# EAGLE design p0-001 (EAGLE 9.5.2)
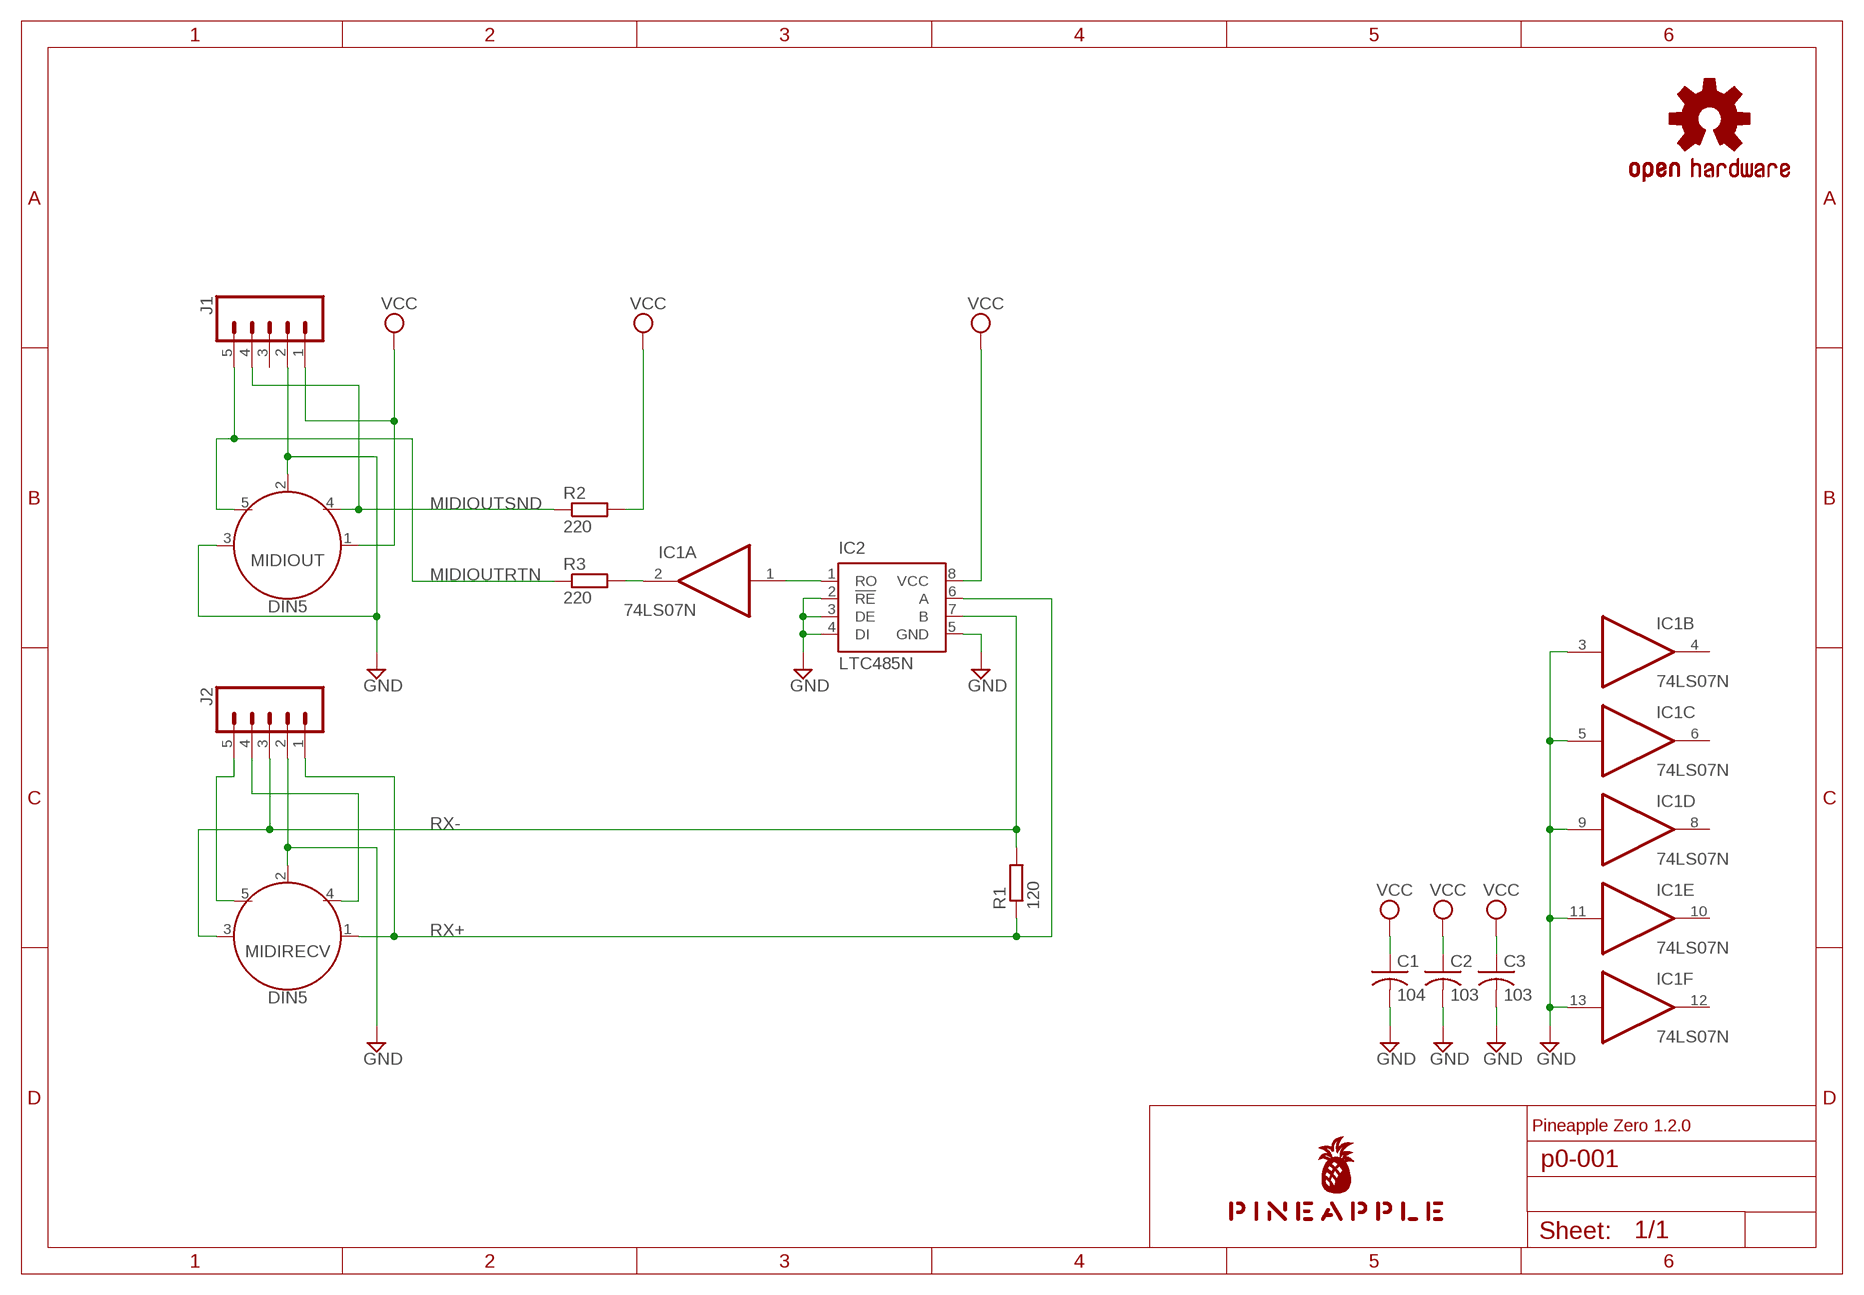
[diagram p0: schematic, sheet 1]

## Parts
C1  104  C-US025-025X050  [C025-025X050]
C2  103  C-US025-025X050  [C025-025X050]
C3  103  C-US025-025X050  [C025-025X050]
IC1  74LS07N  [DIL14]
IC2  LTC485N  [DIL08]
J1  CONN_05JST  [JST-5-PTH]
J2  CONN_05JST  [JST-5-PTH]
LOGO1  OSHW-LOGOS-COPPER  [OSHW-LOGO-S_COPPER]
MIDIOUT  DIN5  [DIN5-RA-PTH]
MIDIRECV  DIN5  [DIN5-RA-PTH]
R1  120  R-EU_0204/5  [0204/5]
R2  220  R-EU_0204/5  [0204/5]
R3  220  R-EU_0204/5  [0204/5]
U$1  PINEAPPLE450  [PINEAPPLE450]

## Nets
DUMMY4: J2.4 MIDIRECV.4
DUMMY5: J2.5 MIDIRECV.5
GND [power]: C1.2 C2.2 C3.2 IC1.3(B:I) IC1.5(C:I) IC1.9(D:I) IC1.11(E:I) IC1.13(F:I) IC2.2(!RE) IC2.3(DE) IC2.4(DI) IC2.5(GND) J1.2 J2.2 MIDIOUT.2 MIDIOUT.3 MIDIRECV.2
MIDIOUTRTN: J1.5 MIDIOUT.5 R3.1
MIDIOUTSND: J1.4 MIDIOUT.4 R2.1
N$1: IC1.2(A:O) R3.2
RX+: IC2.6(A) J2.1 MIDIRECV.1 R1.1
RX-: IC2.7(B) J2.3 MIDIRECV.3 R1.2
TX: IC1.1(A:I) IC2.1(RO)
VCC [power]: C1.1 C2.1 C3.1 IC2.8(VCC) J1.1 MIDIOUT.1 R2.2
Unconnected: IC1.4(B:O) IC1.6(C:O) IC1.8(D:O) IC1.10(E:O) IC1.12(F:O) J1.3

## Notes on the sheet
- Pineapple Zero 1.2.0

## Power pins joined to a net without a drawn wire
GND: IC1.7(P:GND)
VCC: IC1.14(P:VCC)

## Library data of the parts
C1-C3 = rcl:C-US: CAPACITOR, American symbol; SPICEPREFIX: C
IC1 = 74xx-us:74*07: Hex BUFFER, open collector high-voltage output
IC2 = linear-technology:LTC485: Low Power RS485 Interface Transceiver Source: http://www.linear.com/pc/downloadDocument.do?navId=H0,C1,C1007,C1017,P2064,D1718; OC_FARNELL: unknown; OC_NEWARK: unknown
J1 J2 = SparkFun-Connectors:CONN_05: Multi connection point. Often used as Generic Header-pin footprint for 0.1 inch spaced/style header connections On any of the 0.1 inch spaced packages, you can populate with these: Break Away Headers - Straight <https://www.sparkfun.com/products/116> (PRT-00116) Break Away Male Headers - Right Angle <https://www.sparkfun.com/products/553> (PRT-00553) Female Headers <https://www.sparkfun.com/products/115> (PRT-00115) Break Away Headers - Machine Pin <https://www.sparkfun.com/products/117> (PRT-00117) Break Away Female Headers - Swiss Machine Pin <https://www.sparkfun.com/products/743> (PRT-00743) For SCREWTERMINALS and SPRING TERMINALS visit here: Screw Terimnals on SparkFun.com <https://www.sparkfun.com/search/results?term=Screw+Terminals> (5mm/3.5mm/2.54mm spacing) This device is also useful as a general connection point to wire up your design to another part of your project. Our various solder wires solder well into these plated through hole pads. Hook-Up Wire - Assortment (Stranded, 22 AWG) <https://www.sparkfun.com/products/11375> (PRT-11375) Hook-Up Wire - Assortment (Solid Core, 22 AWG) <https://www.sparkfun.com/products/11367> (PRT-11367) View the entire wire category on our website here <https://www.sparkfun.com/categories/141> Special notes: Molex polarized connector foot print use with SKU : PRT-08231 with associated crimp pins and housings. 1MM SMD Version SKU: PRT-10208; SF_ID: PRT-09917
LOGO1 = SparkFun-Aesthetics:OSHW-LOGO: Open-Source Hardware (OSHW) Logo This logo indicates the piece of hardware it is found on incorporates a OSHW license and/or adheres to the definition of open source hardware found here: http://freedomdefined.org/OSHW
MIDIOUT MIDIRECV = SparkFun-Connectors:DIN5: DIN5 Connector - Female Right Angle (frequently used as a MIDI Jack connector) This type of connector and cable is frequently used for transmitting midi data (musical instrument digital interface). It is what you usually see on a keyboard or set of electronic drums. Learn more here <https://en.wikipedia.org/wiki/MIDI>. For more information on the pinout and electrical specifications of MIDI communications, please see the following resource: https://www.midi.org/specifications/item/midi-din-electrical-specification Here is the connector we sell at SparkFun: MIDI Connector - Female Right Angle <https://www.sparkfun.com/products/9536> (PRT-09536) Datasheet <hhttp://www.sparkfun.com/datasheets/Prototyping/Connectors/MIDI-RA.pdf> It is used on this SparkFun product: SparkFun MIDI Shield <https://www.sparkfun.com/products/12898> (DEV-12898); PROD_ID: CONN-09481
R1-R3 = resistor:R-EU_: RESISTOR, European symbol
U$1 = pineapple:PINEAPPLE450

## Net classes
0 default: width 0.152 mm, drill 0.152 mm, clearance 0.152 mm
1 power: width 0.305 mm, drill 0.152 mm, clearance 0.152 mm to class 0, clearance 0.152 mm

## Board
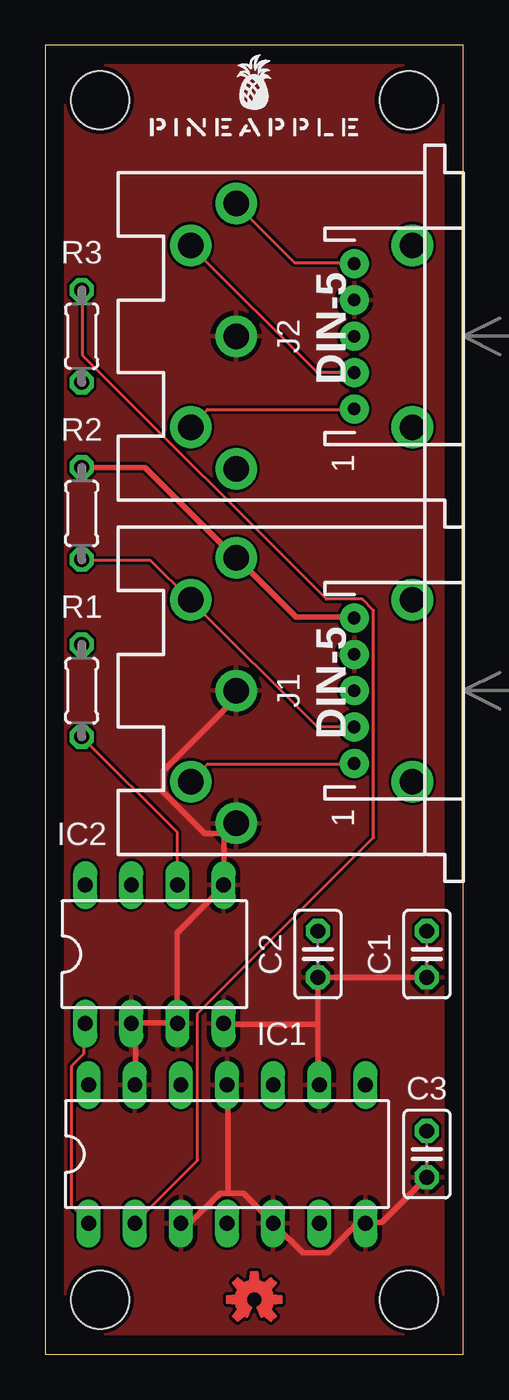
[diagram p1: board, top side]
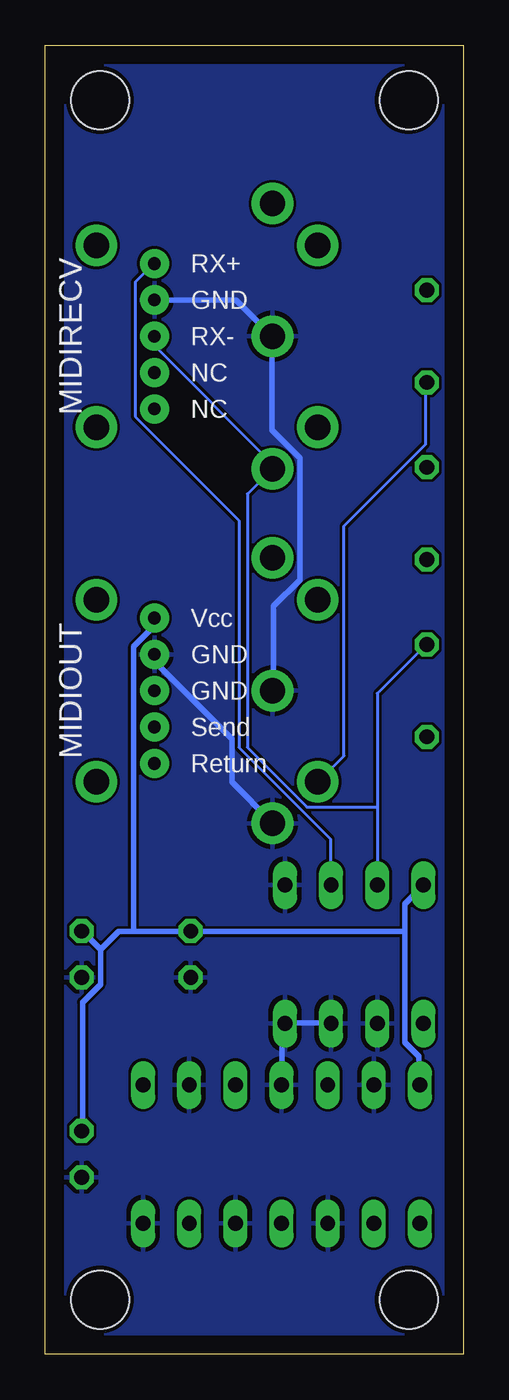
[diagram p2: board, bottom side, seen from below]

Size 23 x 72 mm. Coordinates in mm from the lower left corner, seen from the top.
Outline: 0,0 23,0 23,72 0,72 0,0
Copper layers (1*16): Top 0.035mm / dielectric 1.5mm / Bottom 0.035mm
Design rules "SeeedStudio_2layer_DRU_no_angle_20140221": minimum track width 6mil, minimum drill 12mil, track to track 6mil, track to pad 6mil, pad to pad 6mil, via to via 6mil, smd to smd 0mil, copper to edge 10mil, drill to drill 10mil, minimum pad ring 10mil, minimum via ring 6mil, stop-mask expansion 2mil, vias tented up to drill 100mil, thermal gap 10mil
Holes 3.2 mm at 3,3 20,3 20,69 3,69
tRestrict: area 0,71 to 23,72; area 22,0 to 23,72; area 0,0 to 23,1; area 0,0 to 1,72
bRestrict: area 0,71 to 23,72; area 22,0 to 23,72; area 0,0 to 23,1; area 0,0 to 1,72

### Footprints (pad centres in the part's own frame; a part is rotated, then mirrored left to right if it is on the bottom)
C025-025X050 = drill 0.813 octagon: 1 -1.27,0; 2 1.27,0
DIL14 = drill 0.813 long: 1 -7.62,-3.81; 2 -5.08,-3.81; 3 -2.54,-3.81; 4 0,-3.81; 5 2.54,-3.81; 6 5.08,-3.81; 7 7.62,-3.81; 8 7.62,3.81; 9 5.08,3.81; 10 2.54,3.81; 11 0,3.81; 12 -2.54,3.81; 13 -5.08,3.81; 14 -7.62,3.81
DIL08 = drill 0.813 long: 1 -3.81,-3.81; 2 -1.27,-3.81; 3 1.27,-3.81; 4 3.81,-3.81; 5 3.81,3.81; 6 1.27,3.81; 7 -1.27,3.81; 8 -3.81,3.81
JST-5-PTH = drill 0.7 pad 1.6: 1 -4,0; 2 -2,0; 3 0,0; 4 2,0; 5 4,0
DIN5-RA-PTH = drill 1.4 pad 2.286: 1 7.3,12.5; 2 0,12.5; 3 -7.3,12.5; 4 5,15; 5 -5,15; 6 -5,2.8; 7 5,2.8
0204/5 = drill 0.813 octagon: 1 -2.54,0; 2 2.54,0

### Placement (x,y rotation side)
C1  21,22 270 top
C2  15,22 270 top
C3  21,11 270 top
IC1  10,11 0 top
IC2  6,22 0 top
J1  17,36.5 270 top
J2  17,56 270 top
LOGO1  11.5,3 0 top
MIDIOUT  23,36.5 90 top
MIDIRECV  23,56 90 top
R1  2,36.5 90 top
R2  2,46.25 90 top
R3  2,56 90 top
U$1  11.5,67 0 top

### Tracks (layer width: path | path; a pad name or v marks a point on that pad's centre or on a via)
DUMMY4
  Top 0.152: J2.4 16.99,54.03 14.94,54.03 8,60.96 MIDIRECV.4
DUMMY5
  Top 0.152: J2.5 16.99,51.97 8.91,51.97 8,51.05 MIDIRECV.5
GND
  Top 0.305: 15.01,18.14 15.01,14.86 IC1.9 | 15.01,18.14 C2.2 15.16,20.73 20.95,20.73 C1.2 | C3.2 20.95,9.68 18.52,7.24 17.68,7.24 IC1.7 17.53,7.09 17.07,7.09 15.54,5.56 14.17,5.56 12.65,7.09 IC1.5 12.5,7.24 10.9,8.84 10.06,8.84 | 10.06,8.84 9.6,8.84 8,7.24 7.47,7.24 IC1.3 | IC1.13 4.95,14.86 4.95,18.14 IC2.2 4.8,18.21 7.24,18.21 IC2.3 7.24,18.36 7.24,23.16 9.75,25.68 IC2.5 9.83,25.83 9.83,28.57 10.44,29.18 MIDIOUT.3 9.75,28.65 8.76,28.65 6.48,30.94 6.48,32.08 10.44,36.04 10.44,36.5 MIDIOUT.2 | 10.06,8.84 10.06,14.78 IC1.11 | 15.01,18.14 9.83,18.14 IC2.4
  Bottom 0.305: IC2.3 7.32,18.21 9.75,18.21 IC2.4 9.83,18.06 9.98,17.91 9.98,14.86 IC1.11 | J2.2 16.99,57.99 12.5,57.99 10.52,56.01 MIDIRECV.2 10.52,55.85 10.52,50.83 8.99,49.3 8.99,42.6 10.44,41.15 10.44,36.58 MIDIOUT.2 | J1.2 16.99,38.48 16.99,38.1 12.72,33.83 12.72,31.47 10.52,29.26 MIDIOUT.3
  pour Top: -1,-1 24,-1 24,73 -1,73
  pour Bottom: -2,-2 25,-2 25,74 -2,74
MIDIOUTRTN
  Top 0.152: J1.5 16.99,32.46 8.91,32.46 8,31.55 MIDIOUT.5
  Bottom 0.152: R3.1 2.06,53.42 2.06,50.06 6.55,45.57 6.55,32.92 7.92,31.55 MIDIOUT.5
MIDIOUTSND
  Top 0.152: R2.1 2.06,43.66 5.79,43.66 7.92,41.53 MIDIOUT.4 8,41.45 14.94,34.52 16.99,34.52 J1.4
N$1
  Top 0.152: R3.2 2.06,58.52 2.06,54.94 15.47,41.53 17.45,41.53 18.06,40.92 18.06,28.42 8.38,18.75 8.38,10.67 4.95,7.24 IC1.2
RX+
  Top 0.152: IC2.6 7.24,25.83 7.24,28.73 2.06,33.91 R1.1 | J2.1 16.99,60.05 13.72,60.05 10.52,63.25 MIDIRECV.1
  Bottom 0.152: IC2.6 7.32,25.83 7.32,28.35 12.34,33.38 12.34,45.87 18.06,51.59 18.06,58.98 17.07,59.97 J2.1
RX-
  Bottom 0.152: 4.72,30.1 4.72,36.35 2.06,39.01 R1.2 | 4.72,30.1 4.72,25.83 IC2.7 | J2.3 16.99,55.93 16.99,55.47 10.52,49 10.52,48.77 MIDIRECV.3 10.52,48.69 11.89,47.32 11.89,33.38 8.61,30.1 4.72,30.1
TX
  Top 0.152: IC2.1 2.13,18.14 2.13,16.54 1.45,15.85 1.45,8.15 2.36,7.24 IC1.1
VCC
  Top 0.305: R2.2 2.06,48.77 5.49,48.77 10.44,43.81 MIDIOUT.1 10.59,43.74 13.79,40.54 16.99,40.54 J1.1
  Bottom 0.305: 3.2,23.24 3.2,24.77 2.21,25.76 IC2.8 | 3.2,23.24 3.2,17.14 2.44,16.38 2.44,14.86 IC1.14 | 19.96,22.25 19.96,20.34 20.95,19.36 20.95,12.34 C3.1 | 19.96,22.25 20.95,23.24 C1.1 | 18.14,23.24 18.97,23.24 19.96,22.25 | 18.14,23.24 15.01,23.24 C2.1 14.86,23.24 3.2,23.24 | 18.14,23.24 18.14,38.94 17.07,40.01 17.07,40.46 J1.1

### Text on the board
tPlace: 1 | 1
bNames: RX+ | GND | RX- | NC | NC | Vcc | GND | GND | Send | Return